# Altium schematic sheet TI82_matlab.SchDoc
size A3
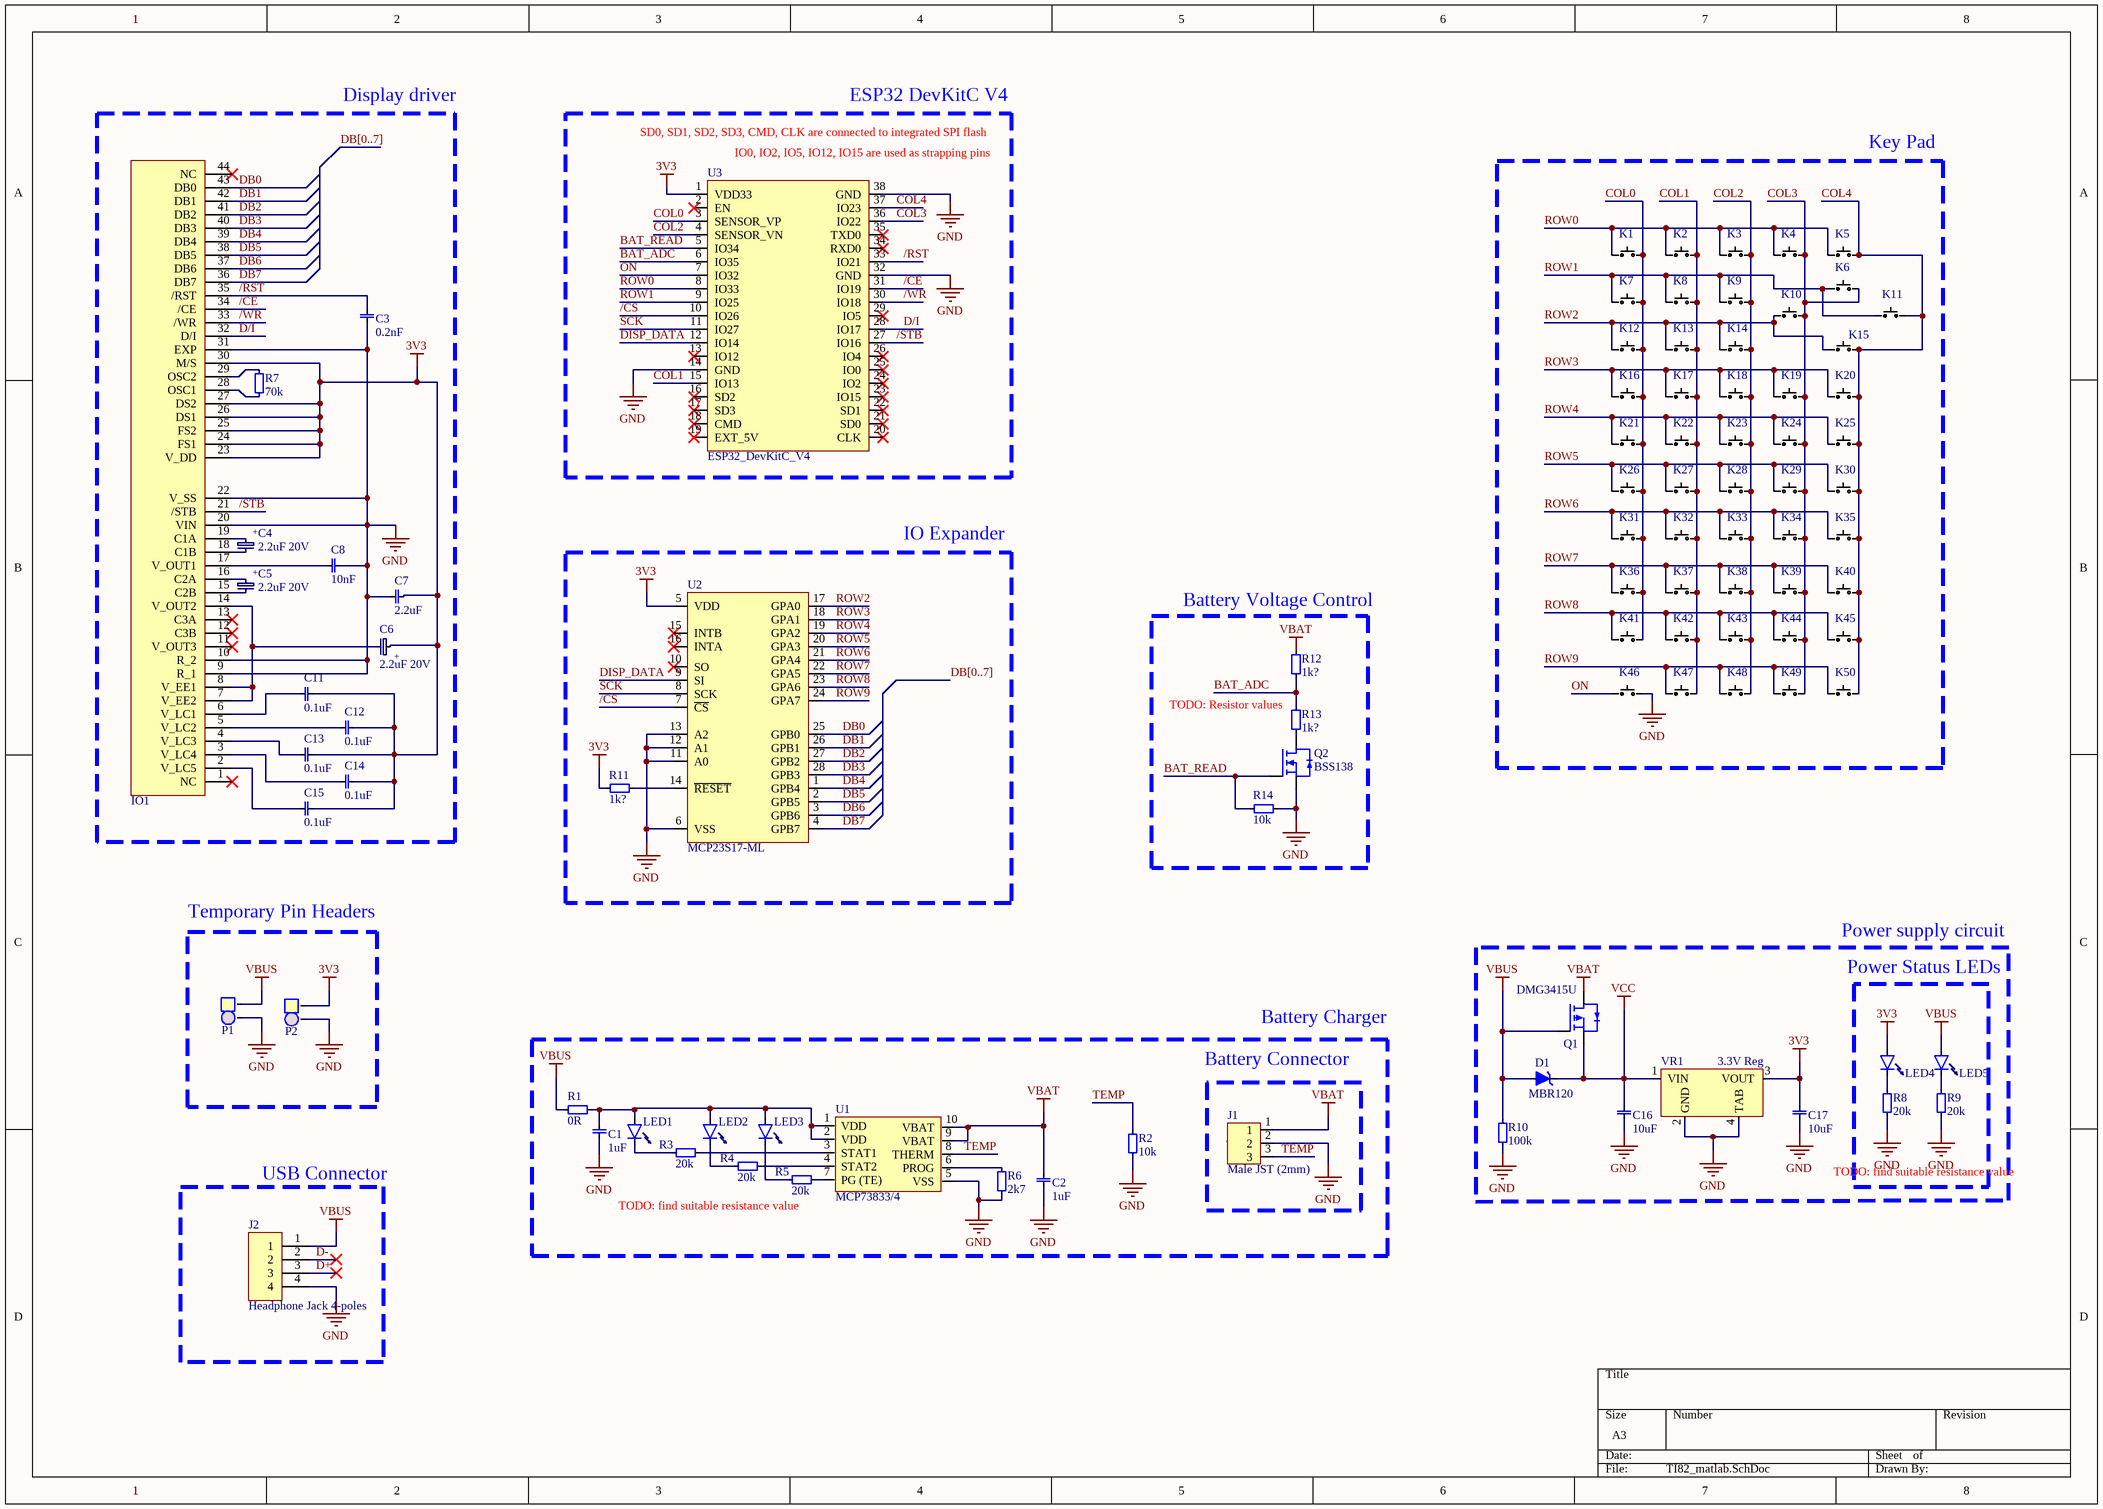
[diagram p0: TI82_matlab.SchDoc]

## Parts
C1  value 1uF  [0603 cap]  (hidden comment: 0603, capacitor)
C2  value 1uF  [0603 cap]  (hidden comment: 0603, capacitor)
C3  value 0.2nF  [0603 cap]  (hidden comment: 0603, capacitor)
C4  Parameter 1: 2.2uF 20V  [CAP 1206 BIPOLAR]  (hidden comment: Cap, bipolar)
C5  Parameter 1: 2.2uF 20V  [CAP 1206 BIPOLAR]  (hidden comment: Cap, bipolar)
C6  Parameter 1: 2.2uF 20V  [CAP 1206 BIPOLAR]  (hidden comment: Cap, bipolar)
C7  value 2.2uF  [0603 cap]  (hidden comment: 0603, capacitor)
C8  value 10nF  [0603 cap]  (hidden comment: 0603, capacitor)
C11  value 0.1uF  [0603 cap]  (hidden comment: 0603, capacitor)
C12  value 0.1uF  [0603 cap]  (hidden comment: 0603, capacitor)
C13  value 0.1uF  [0603 cap]  (hidden comment: 0603, capacitor)
C14  value 0.1uF  [0603 cap]  (hidden comment: 0603, capacitor)
C15  value 0.1uF  [0603 cap]  (hidden comment: 0603, capacitor)
C16  value 10uF  [0603 cap]  (hidden comment: 0603, capacitor)
C17  value 10uF  [0603 cap]  (hidden comment: 0603, capacitor)
D1  MBR120  [SOD-123]
IO1  Display IO*  [Display IO 44]  (value not drawn)
J1  Male JST (2mm)  [3P JST Male connector]
J2  Headphone Jack 4-poles  [Headphone Jack 4-poles]
K1  Button Pad  [BUTTON PAD 2]  (value not drawn)
K2  Button Pad  [BUTTON PAD 2]  (value not drawn)
K3  Button Pad  [BUTTON PAD 2]  (value not drawn)
K4  Button Pad  [BUTTON PAD 2]  (value not drawn)
K5  Button Pad  [BUTTON PAD 2]  (value not drawn)
K6  Button Pad  [BUTTON PAD 2]  (value not drawn)
K7  Button Pad  [BUTTON PAD 2]  (value not drawn)
K8  Button Pad  [BUTTON PAD 2]  (value not drawn)
K9  Button Pad  [BUTTON PAD 2]  (value not drawn)
K10  Button Pad  [BUTTON PAD 2]  (value not drawn)
K11  Button Pad  [BUTTON PAD 2]  (value not drawn)
K12  Button Pad  [BUTTON PAD 2]  (value not drawn)
K13  Button Pad  [BUTTON PAD 2]  (value not drawn)
K14  Button Pad  [BUTTON PAD 2]  (value not drawn)
K15  Button Pad  [BUTTON PAD 2]  (value not drawn)
K16  Button Pad  [BUTTON PAD 2]  (value not drawn)
K17  Button Pad  [BUTTON PAD 2]  (value not drawn)
K18  Button Pad  [BUTTON PAD 2]  (value not drawn)
K19  Button Pad  [BUTTON PAD 2]  (value not drawn)
K20  Button Pad  [BUTTON PAD 2]  (value not drawn)
K21  Button Pad  [BUTTON PAD 2]  (value not drawn)
K22  Button Pad  [BUTTON PAD 2]  (value not drawn)
K23  Button Pad  [BUTTON PAD 2]  (value not drawn)
K24  Button Pad  [BUTTON PAD 2]  (value not drawn)
K25  Button Pad  [BUTTON PAD 2]  (value not drawn)
K26  Button Pad  [BUTTON PAD 2]  (value not drawn)
K27  Button Pad  [BUTTON PAD 2]  (value not drawn)
K28  Button Pad  [BUTTON PAD 2]  (value not drawn)
K29  Button Pad  [BUTTON PAD 2]  (value not drawn)
K30  Button Pad  [BUTTON PAD 2]  (value not drawn)
K31  Button Pad  [BUTTON PAD 2]  (value not drawn)
K32  Button Pad  [BUTTON PAD 2]  (value not drawn)
K33  Button Pad  [BUTTON PAD 2]  (value not drawn)
K34  Button Pad  [BUTTON PAD 2]  (value not drawn)
K35  Button Pad  [BUTTON PAD 2]  (value not drawn)
K36  Button Pad  [BUTTON PAD 2]  (value not drawn)
K37  Button Pad  [BUTTON PAD 2]  (value not drawn)
K38  Button Pad  [BUTTON PAD 2]  (value not drawn)
K39  Button Pad  [BUTTON PAD 2]  (value not drawn)
K40  Button Pad  [BUTTON PAD 2]  (value not drawn)
K41  Button Pad  [BUTTON PAD 2]  (value not drawn)
K42  Button Pad  [BUTTON PAD 2]  (value not drawn)
K43  Button Pad  [BUTTON PAD 2]  (value not drawn)
K44  Button Pad  [BUTTON PAD 2]  (value not drawn)
K45  Button Pad  [BUTTON PAD 2]  (value not drawn)
K46  Button Pad  [BUTTON PAD 2]  (value not drawn)
K47  Button Pad  [BUTTON PAD 2]  (value not drawn)
K48  Button Pad  [BUTTON PAD 2]  (value not drawn)
K49  Button Pad  [BUTTON PAD 2]  (value not drawn)
K50  Button Pad  [BUTTON PAD 2]  (value not drawn)
LED1  0805, LED  [0805_led]  (value not drawn)
LED2  0805, LED  [0805_led]  (value not drawn)
LED3  0805, LED  [0805_led]  (value not drawn)
LED4  0805, LED  [0805_led]  (value not drawn)
LED5  0805, LED  [0805_led]  (value not drawn)
P1  1x2 Pin Header  [padtwo_L]  (value not drawn)
P2  1x2 Pin Header  [padtwo_L]  (value not drawn)
Q1  DMG3415U  [SOT23]
Q2  BSS138  [SOT23]
R1  value 0R  [0603]  (hidden comment: 0603, resistor)
R2  value 10k  [0603]  (hidden comment: 0603, resistor)
R3  value 20k  [0603]  (hidden comment: 0603, resistor)
R4  value 20k  [0603]  (hidden comment: 0603, resistor)
R5  value 20k  [0603]  (hidden comment: 0603, resistor)
R6  value 2k7  [0603]  (hidden comment: 0603, resistor)
R7  value 70k  [0603]  (hidden comment: 0603, resistor)
R8  value 20k  [0603]  (hidden comment: 0603, resistor)
R9  value 20k  [0603]  (hidden comment: 0603, resistor)
R10  value 100k  [0603]  (hidden comment: 0603, resistor)
R11  value 1k?  [0603]  (hidden comment: 0603, resistor)
R12  value 1k?  [0603]  (hidden comment: 0603, resistor)
R13  value 1k?  [0603]  (hidden comment: 0603, resistor)
R14  value 10k  [0603]  (hidden comment: 0603, resistor)
U1  MCP73833/4  [MSOP-10]
U2  MCP23S17-ML  [QFN28 0.65 Pitch]
U3  ESP32_DevKitC_V4  [ESP32_DevKitC_V4]
VR1  3.3V Reg  [SOT223]

## Blocks framed on the sheet
Display driver: C3-C8 C11-C15 IO1 R7
ESP32 DevKitC V4: U3
Key Pad: K1-K50
IO Expander: R11 U2
Battery Voltage Control: Q2 R12-R14
Temporary Pin Headers: P1 P2
Battery Charger: C1 C2 LED1-LED3 R1-R6 U1
Battery Connector: J1
USB Connector: J2

## Nets
3V3: C6.1 C7.0 C11.0 C12.0 C13.0 C14.0 C15.0 C17.1 IO1.23(V_DD) IO1.24(FS1) IO1.25(FS2) IO1.26(DS1) IO1.27(DS2) IO1.30(M/S) LED4.1 P2.1 R11.1 U2.5(VDD) U3.1(VDD33) VR1.3(VOUT)
GND: C1.0 C2.0 C3.0 C7.1 C8.0 C16.0 C17.0 IO1.9(R_1) IO1.10(R_2) IO1.20(VIN) IO1.22(V_SS) IO1.31(EXP) J1.2 J2.4 K46.1 P1.2 P2.2 Q2.2(S) R2.1 R6.1 R8.1 R9.1 R10.1 R14.1 U1.5(VSS) U2.6(VSS) U2.11(A0) U2.12(A1) U2.13(A2) U3.14(GND) U3.32(GND) U3.38(GND) VR1.2(GND) VR1.4(TAB)
VBAT: C2.1 J1.1 Q1.3(D) R12.0 U1.9(VBAT) U1.10(VBAT)
VBUS: D1.2 J2.1 LED5.1 P1.1 Q1.1(G) R1.0 R10.0
VCC: C16.1 D1.1 Q1.2(S) VR1.1(VIN)
/CE: IO1.34(/CE) U3.31(IO19)
/CS: U2.7(~{CS}) U3.10(IO26)
/RST: C3.1 IO1.35(/RST) U3.33(IO21)
/STB: IO1.21(/STB) U3.27(IO16)
/WR: IO1.33(/WR) U3.30(IO18)
BAT_ADC: R12.1 R13.0 U3.6(IO35)
BAT_READ: Q2.1(G) R14.0 U3.5(IO34)
COL0: K1.1 K7.1 K12.1 K16.1 K21.1 K26.1 K31.1 K36.1 K41.1 U3.3(SENSOR_VP)
COL1: K2.1 K8.1 K13.1 K17.1 K22.1 K27.1 K32.1 K37.1 K42.1 K47.1 U3.15(IO13)
COL2: K3.1 K9.1 K14.1 K18.1 K23.1 K28.1 K33.1 K38.1 K43.1 K48.1 U3.4(SENSOR_VN)
COL3: K4.1 K6.1 K10.1 K19.1 K24.1 K29.1 K34.1 K39.1 K44.1 K49.1 U3.36(IO22)
COL4: K5.1 K11.1 K15.1 K20.1 K25.1 K30.1 K35.1 K40.1 K45.1 K50.1 U3.37(IO23)
D+: J2.3
D-: J2.2
D/I: IO1.32(D/I) U3.28(IO17)
DB0: IO1.43(DB0) U2.25(GPB0)
DB1: IO1.42(DB1) U2.26(GPB1)
DB2: IO1.41(DB2) U2.27(GPB2)
DB3: IO1.40(DB3) U2.28(GPB3)
DB4: IO1.39(DB4) U2.1(GPB4)
DB5: IO1.38(DB5) U2.2(GPB5)
DB6: IO1.37(DB6) U2.3(GPB6)
DB7: IO1.36(DB7) U2.4(GPB7)
DISP_DATA: U2.9(SI) U3.12(IO14)
ON: K46.2 U3.7(IO32)
ROW0: K1.2 K2.2 K3.2 K4.2 K5.2 U3.8(IO33)
ROW1: K6.2 K7.2 K8.2 K9.2 K11.2 U3.9(IO25)
ROW2: K10.2 K12.2 K13.2 K14.2 K15.2 U2.17(GPA0)
ROW3: K16.2 K17.2 K18.2 K19.2 K20.2 U2.18(GPA1)
ROW4: K21.2 K22.2 K23.2 K24.2 K25.2 U2.19(GPA2)
ROW5: K26.2 K27.2 K28.2 K29.2 K30.2 U2.20(GPA3)
ROW6: K31.2 K32.2 K33.2 K34.2 K35.2 U2.21(GPA4)
ROW7: K36.2 K37.2 K38.2 K39.2 K40.2 U2.22(GPA5)
ROW8: K41.2 K42.2 K43.2 K44.2 K45.2 U2.23(GPA6)
ROW9: K47.2 K48.2 K49.2 K50.2 U2.24(GPA7)
SCK: U2.8(SCK) U3.11(IO27)
TEMP: J1.3 R2.0 U1.8(THERM)
NetC1_1: C1.1 LED1.1 LED2.1 LED3.1 R1.1 U1.1(VDD) U1.2(VDD)
NetC4_0: C4.0 IO1.18(C1B)
NetC4_1: C4.1 IO1.19(C1A)
NetC5_0: C5.0 IO1.15(C2B)
NetC5_1: C5.1 IO1.16(C2A)
NetC6_0: C6.0 IO1.7(V_EE2) IO1.8(V_EE1) IO1.14(V_OUT2)
NetC8_1: C8.1 IO1.17(V_OUT1)
NetC11_1: C11.1 IO1.6(V_LC1)
NetC12_1: C12.1 IO1.5(V_LC2)
NetC13_1: C13.1 IO1.4(V_LC3)
NetC14_1: C14.1 IO1.3(V_LC4)
NetC15_1: C15.1 IO1.2(V_LC5)
NetIO1_28: IO1.28(OSC1) R7.1
NetIO1_29: IO1.29(OSC2) R7.0
NetLED1_0: LED1.0(Cathode) R3.0
NetLED2_0: LED2.0(Cathode) R4.0
NetLED3_0: LED3.0(Cathode) R5.0
NetLED4_0: LED4.0(Cathode) R8.0
NetLED5_0: LED5.0(Cathode) R9.0
NetQ2_3: Q2.3(D) R13.1
NetR3_1: R3.1 U1.3(STAT1)
NetR4_1: R4.1 U1.4(STAT2)
NetR5_1: R5.1 U1.7(PG_(TE))
NetR6_0: R6.0 U1.6(PROG)
NetR11_0: R11.0 U2.14(~{RESET})

Not connected (* = marked no-connect by the designer): IO1 1(NC)* 11(V_OUT3)* 12(C3B)* 13(C3A)* 44(NC)*; U2 10(SO)* 15(INTB)* 16(INTA)*; U3 2(EN)* 13(IO12)* 16(SD2)* 17(SD3)* 18(CMD)* 19(EXT_5V)* 20(CLK)* 21(SD0)* 22(SD1)* 23(IO15)* 24(IO2)* 25(IO0)* 26(IO4)* 29(IO5)* 34(RXD0)* 35(TXD0)*

## Buses and harness runs
bus DB[0..7]

## Notes on the sheet
- SD0, SD1, SD2, SD3, CMD, CLK are connected to integrated SPI flash
- (near U3) IO0, IO2, IO5, IO12, IO15 are used as strapping pins
- (near R13) TODO: Resistor values
- Power supply circuit
- Power Status LEDs
- (near J1) TODO
- TODO: find suitable resistance value
- (in symbol Cap, bipolar) +

## Library data of the parts
D1 = MBR120: Schottky Power Rectifier; Value: Schottky Diod; Mouser: 863-MBR120ESFT1G
IO1 = Desplay IO 22: Display Pins for TI-82 STATS
J1 = PCB HEADER 3P: Battery connector
LED1-LED5 = 0805, LED: Value: 0805 LED
P1 P2 = 1x2 Pin Header: 2.54 mm, TH; Value: 1x2 Pin Header
Q1 = DMG3415U: P-CHANNEL ENHANCEMENT MODE MOSFET; Value: pMOSFET Enhancement; Mouser: 621-DMG3415U-7
U1 = MCP73833/4: Stand-Alone Linear Li-Ion / Li-Polymer Charge / Management Controller; Value: Battery Charger; Mouser: 579-MCP73833T-FCI/UN
VR1 = MCP1826S